# EAGLE design geyser-001 (EAGLE 8.7.0)
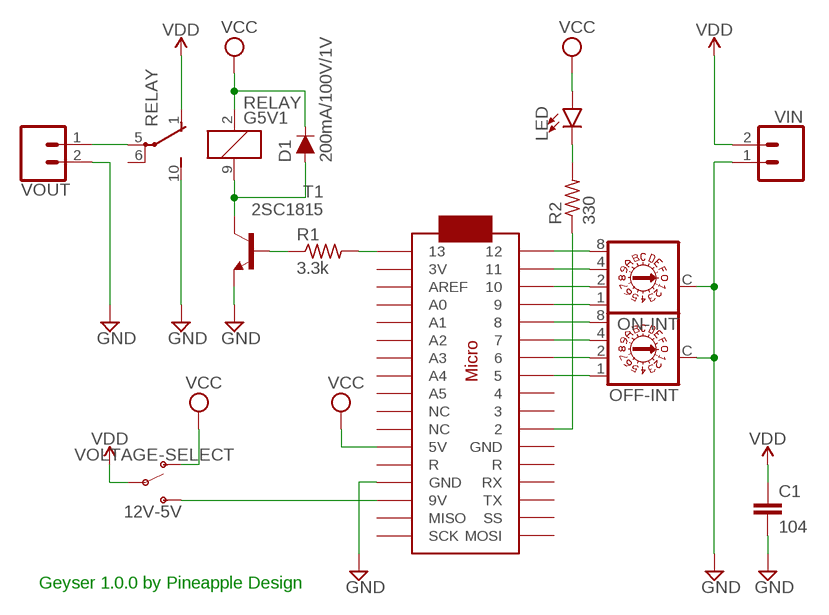
[diagram p0: schematic, sheet 1]

## Parts
C1  104  C2,5-3  [C2.5-3]
D1  200mA/100V/1V  DIODE-1N4148  [DIODE-1N4148]
LED  LED-3MM-NO_SILK  [LED_3MM-NS]
OFF-INT  A1353HEX  [A1353HEX]
ON-INT  A1353HEX  [A1353HEX]
R1  3.3k  R-US_0204/5  [0204/5]
R2  330  R-US_0204/5  [0204/5]
RELAY  G5V1  [G5V1]
T1  2SC1815  [TO92-ECB]
U$1  ARDUINOMICRO  [ARDUINOMICRO]
VIN  CONN_02JST-PTH-2  [JST-2-PTH]
VOLTAGE-SELECT  12V-5V  SWITCH-SPDT-PTH-11.6X4.0MM  [SWITCH_SPDT_PTH_11.6X4.0MM]
VOUT  CONN_02JST-PTH-2  [JST-2-PTH]

## Nets
GND: C1.2 OFF-INT.C ON-INT.C RELAY.10(2:S) T1.E U$1.P$12(GND) VIN.1 VOUT.2
LEDDRIVE: R2.1 U$1.P$11
N$2: OFF-INT.8 U$1.P$5
N$3: R1.1 T1.B
N$4: D1.A RELAY.9 T1.C
N$5: OFF-INT.4 U$1.P$6
N$6: OFF-INT.2 U$1.P$7
N$7: ON-INT.8 U$1.P$1
N$8: ON-INT.4 U$1.P$2
N$9: ON-INT.2 U$1.P$3
N$10: ON-INT.1 U$1.P$4
N$11: OFF-INT.1 U$1.P$8
N$14: LED.K(C) R2.2
RELAYDRIVE: R1.2 U$1.P$34
VCC: D1.C LED.A RELAY.2 U$1.P$23(5V) VOLTAGE-SELECT.1(O)
VDD: C1.1 RELAY.1(2:O) VIN.2 VOLTAGE-SELECT.2(P)
VIN: U$1.P$20(9V) VOLTAGE-SELECT.3(S)
VOUT: RELAY.5(2:P) VOUT.1
Unconnected: RELAY.6(2:P) U$1.P$9 U$1.P$10 U$1.P$13(R) U$1.P$14(RX) U$1.P$15(TX) U$1.P$16(SS) U$1.P$17(MOSI) U$1.P$18(SCK) U$1.P$19(MISO) U$1.P$21(GND) U$1.P$22(R) U$1.P$24(NC) U$1.P$25(NC) U$1.P$26(A5) U$1.P$27(A4) U$1.P$28(A3) U$1.P$29(A2) U$1.P$30(A1) U$1.P$31(A0) U$1.P$32(AREF) U$1.P$33(3V)

## Notes on the sheet
- Geyser 1.0.0 by Pineapple Design

## Library data of the parts
C1 = capacitor-wima:C: CAPACITOR naming: grid - package width
D1 = SparkFun-DiscreteSemi:DIODE: Diode These are standard reverse protection diodes and small signal diodes. SparkFun Products: SparkFun SparkPunk Sound Kit <https://www.sparkfun.com/products/11177> SparkFun ESP8266 Thing <https://www.sparkfun.com/products/13231>; PROD_ID: DIO-08378
LED = SparkFun-LED:LED: LED (Generic) Standard schematic elements and footprints for 5mm, 3mm, 1206, and 0603 sized LEDs. Generic LEDs with no color specified.
OFF-INT ON-INT = switch-dil:A1353HEX: DIL/CODE SWITCH; OC_FARNELL: unknown; OC_NEWARK: unknown
R1 R2 = resistor:R-US_: RESISTOR, American symbol
RELAY = relay:G5V1: RELAY 1 x switch, 0.5 A/125 V AC, 1 A/24 V DC , Omron; MPN: G5V-1-DC24; OC_FARNELL: 9949593; OC_NEWARK: 36M6377
T1 = transistor:2SC1815: NPN EPITAXIAL TRANSISTOR Source: TOSHIBA .. 2SC1815 1.pdf
U$1 = adafruit:ARDUINOMICRO
VIN VOUT = SparkFun-Connectors:CONN_02: Multi connection point. Often used as Generic Header-pin footprint for 0.1 inch spaced/style header connections On any of the 0.1 inch spaced packages, you can populate with these: Break Away Headers - Straight <https://www.sparkfun.com/products/116> (PRT-00116) Break Away Male Headers - Right Angle <https://www.sparkfun.com/products/553> (PRT-00553) Female Headers <https://www.sparkfun.com/products/115> (PRT-00115) Break Away Headers - Machine Pin <https://www.sparkfun.com/products/117> (PRT-00117) Break Away Female Headers - Swiss Machine Pin <https://www.sparkfun.com/products/743> (PRT-00743) For SCREWTERMINALS and SPRING TERMINALS visit here: Screw Terimnals on SparkFun.com <https://www.sparkfun.com/search/results?term=Screw+Terminals> (5mm/3.5mm/2.54mm spacing) This device is also useful as a general connection point to wire up your design to another part of your project. Our various solder wires solder well into these plated through hole pads. Hook-Up Wire - Assortment (Stranded, 22 AWG) <https://www.sparkfun.com/products/11375> (PRT-11375) Hook-Up Wire - Assortment (Solid Core, 22 AWG) <https://www.sparkfun.com/products/11367> (PRT-11367) View the entire wire category on our website here <https://www.sparkfun.com/categories/141> Special notes: Molex polarized connector foot print use with: PRT-08233 with associated crimp pins and housings. 2.54_SCREWTERM for use with PRT-10571. 3.5mm Screw Terminal footprints for PRT-08084 5mm Screw Terminal footprints for use with PRT-08432; PROD_ID: CONN-09863; SKU: PRT-09914
VOLTAGE-SELECT = SparkFun-Switches:SWITCH-SPDT: Single Pole, Double Throw (SPDT) Switch Single-pole, double-throw (SPDT) switch. Variant Overview SMD-AYZ0202 Surface Mount DPDT Switch <https://www.sparkfun.com/products/597> (COM-00597) Used on e.g. LilyPad Arduino USB - ATmega32U4 Board <https://www.sparkfun.com/products/12049> PTH-11.6X4.0MM SPDT Mini Power Switch <https://www.sparkfun.com/products/102> (COM-00102) Used on e.g. SparkFun Simon Says - Through-Hole Soldering Kit <https://www.sparkfun.com/products/10547> (KIT-10547) PTH-11.6X4.0MM-KIT KIT version of SPDT Mini Power Switch - Simplifies soldering by removing tStop of switch pins - only one side can be soldered. PTH-11.6X4.0MM-LOCK LOCK version of SPDT Mini Power Switch - Offset pins hold switch in place for easier soldering. SMD-RIGHT-ANGLE Surface Mount Right Angle Switch <https://www.sparkfun.com/products/10860> (COM-10860) Used on e.g. SparkFun ESP8266 Thing <https://www.sparkfun.com/products/13231>; PROD_ID: SWCH-08261; SF_SKU: COM-00102

## Net classes
0 default: width 0.254 mm, drill 0.254 mm, clearance 0.254 mm

## Board
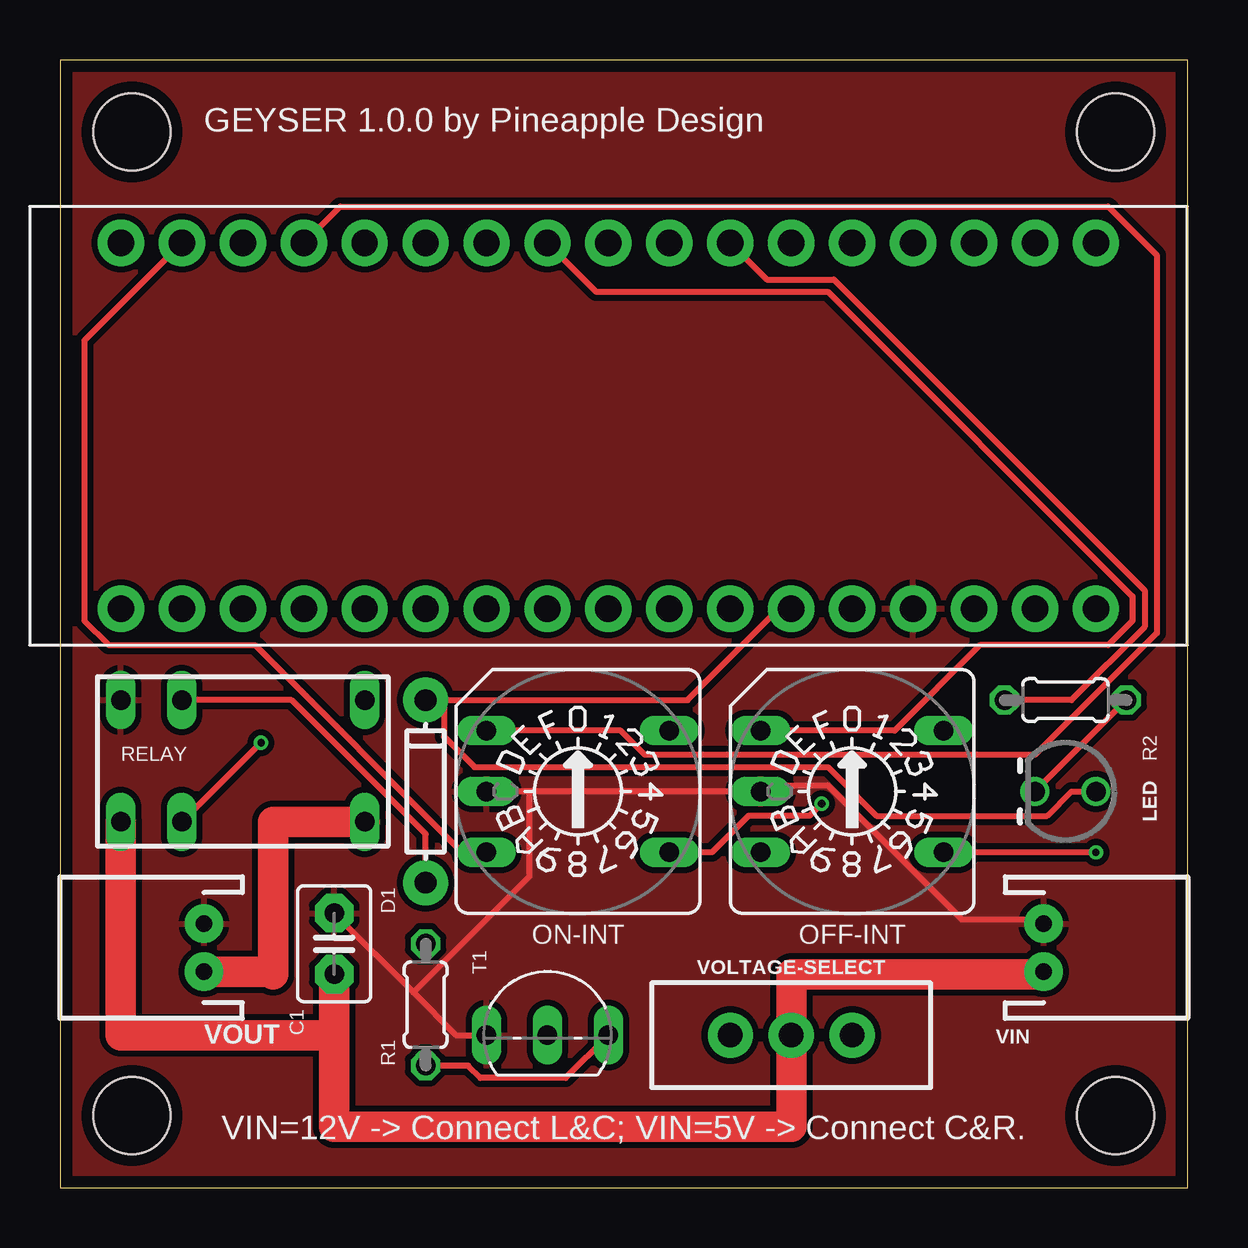
[diagram p1: board, top side]
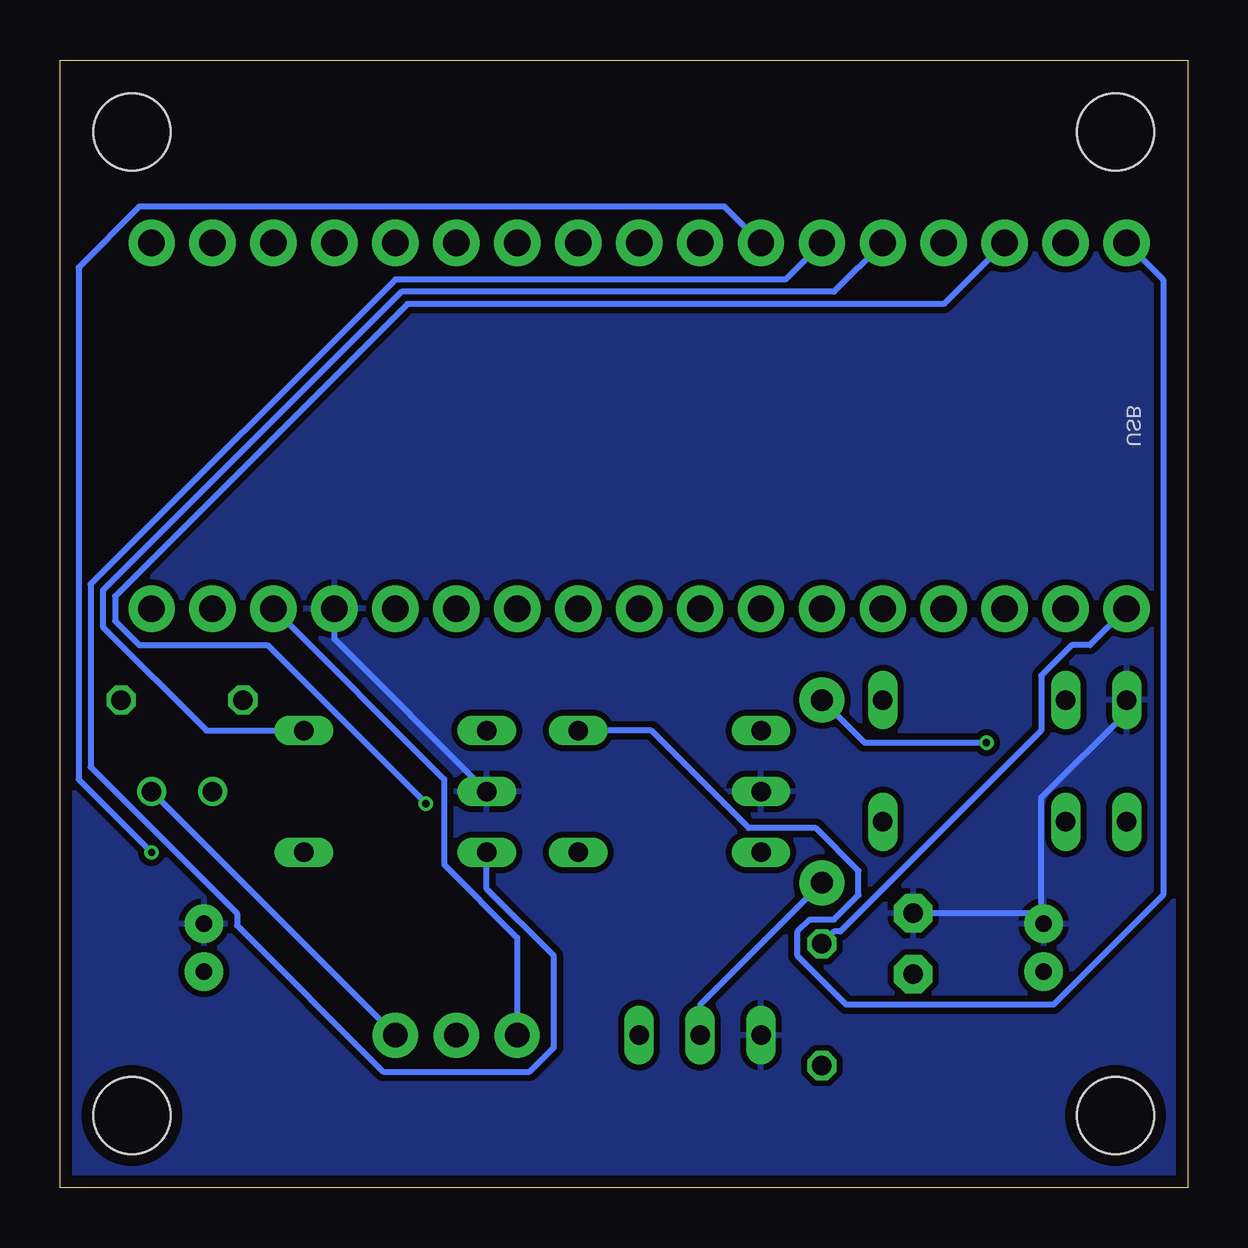
[diagram p2: board, bottom side, seen from below]

Size 47 x 47 mm. Coordinates in mm from the lower left corner, seen from the top.
Outline: 0,0 47,0 47,47 0,47 0,0
Copper layers (1*16): Top 0.035mm / dielectric 1.53mm / Bottom 0.035mm
Design rules "pban_5mil-l2": minimum track width 5mil, minimum drill 0.3mm, track to track 5mil, track to pad 0.229mm, pad to pad 5mil, via to via 5mil, smd to smd 5mil, copper to edge 0.5mm, drill to drill 0.5mm, minimum pad ring 0.15mm, minimum via ring 0.15mm, stop-mask expansion 4mil, vias tented up to drill 0.35mm, thermal gap 10mil
Holes 3.2 mm at 3,3 44,3 3,44 44,44

### Footprints (pad centres in the part's own frame; a part is rotated, then mirrored left to right if it is on the bottom)
C2.5-3 = drill 0.813 pad 1.6 octagon: 1 -1.27,0; 2 1.27,0
DIODE-1N4148 = drill 0.9 pad 1.88: A -3.81,0; C 3.81,0
LED_3MM-NS = drill 0.813: A -1.27,0; K 1.27,0
A1353HEX = drill 0.813 long: 1 3.81,-2.54; 2 -3.81,2.54; 4 3.81,2.54; 8 -3.81,-2.54; C 3.81,0
0204/5 = drill 0.813 octagon: 1 -2.54,0; 2 2.54,0
G5V1 = drill 0.813 long: 1 -5.08,-2.54; 2 -2.54,-2.54; 5 5.08,-2.54; 6 5.08,2.54; 9 -2.54,2.54; 10 -5.08,2.54
TO92-ECB = drill 0.813 long: B 2.54,0; C 0,0; E -2.54,0
ARDUINOMICRO = drill 1.1 pad 1.93: P$1 -20.32,7.62; P$2 -17.78,7.62; P$3 -15.24,7.62; P$4 -12.7,7.62; P$5 -10.16,7.62; P$6 -7.62,7.62; P$7 -5.08,7.62; P$8 -2.54,7.62; P$9 0,7.62; P$10 2.54,7.62; P$11 5.08,7.62; P$12 12.7,-7.62; P$13 10.16,-7.62; P$14 12.7,7.62; P$15 15.24,7.62; P$16 17.78,7.62; P$17 20.32,7.62; P$18 20.32,-7.62; P$19 17.78,-7.62; P$20 15.24,-7.62; P$21 7.62,7.62; P$22 10.16,7.62; P$23 7.62,-7.62; P$24 5.08,-7.62; P$25 2.54,-7.62; P$26 0,-7.62; P$27 -2.54,-7.62; P$28 -5.08,-7.62; P$29 -7.62,-7.62; P$30 -10.16,-7.62; P$31 -12.7,-7.62; P$32 -15.24,-7.62; P$33 -17.78,-7.62; P$34 -20.32,-7.62
JST-2-PTH = drill 0.7 pad 1.6: 1 -1,0; 2 1,0
SWITCH_SPDT_PTH_11.6X4.0MM = drill 1.016 pad 1.88: 1 0,2.54; 2 0,0; 3 0,-2.54

### Placement (x,y rotation side)
C1  11.43,10.16 90 top
D1  15.24,16.51 90 top
LED  41.91,16.51 180 top
OFF-INT  33.02,16.51 180 top
ON-INT  21.59,16.51 180 top
R1  15.24,7.62 90 top
R2  41.91,20.32 0 top
RELAY  7.62,17.78 0 top
T1  20.32,6.35 0 top
U$1  22.86,31.75 0 top
VIN  41,10 270 top
VOLTAGE-SELECT  30.48,6.35 270 top
VOUT  6,10 90 top

### Tracks (layer width: path | path; a pad name or v marks a point on that pad's centre or on a via)
GND
  Top 0.254: T1.E 16.51,6.35 14.73,8.13 | C1.2 14.73,8.13 | 19.56,16.51 OFF-INT.C 29.46,16.76 32,16.76 37.59,11.18 40.89,11.18 VIN.1 | 19.56,16.51 ON-INT.C | 14.73,8.13 19.56,12.95 19.56,16.51
  Bottom 0.254: RELAY.10 2.54,19.81 6.1,16.26 6.1,11.43 | 6.1,11.43 6.1,11.18 VOUT.2 6.1,11.43 | 6.1,11.43 C1.2 | U$1.P$12 35.56,22.86 OFF-INT.C
  pour Top (isolate 0.254): 0,0 47,0 47,47 0,47
  pour Bottom (isolate 0.254): 0,0 47,0 47,47 0,47
LEDDRIVE
  Top 0.254: R2.1 42.16,20.32 45.21,23.37 45.21,24.89 32.26,37.85 29.46,37.85 U$1.P$11
N$2
  Bottom 0.254: OFF-INT.8 40.89,19.05 45.21,23.37 45.21,24.89 32.77,37.34 14.73,37.34 U$1.P$5
N$3
  Top 0.254: R1.1 17.02,5.08 17.53,4.57 21.08,4.57 T1.B
N$4
  Top 0.254: RELAY.9 9.65,20.32 15.24,14.73 D1.A
  Bottom 0.254: T1.C 20.32,7.62 D1.A
N$5
  Bottom 0.254: OFF-INT.4 29.21,12.45 26.42,9.65 26.42,5.84 27.43,4.83 33.53,4.83 39.62,10.92 39.62,11.43 45.72,17.53 45.72,25.15 33.02,37.85 16.76,37.85 U$1.P$6
N$6  (via drill 0.3)
  Top 0.254: v43.18,13.97 OFF-INT.2
  Bottom 0.254: v43.18,13.97 46.23,17.02 46.23,38.35 43.69,40.89 19.3,40.89 U$1.P$7
N$7
  Bottom 0.254: ON-INT.8 22.35,19.05 18.29,14.99 15.49,14.99 13.72,13.21 13.72,12.19 14.73,11.18 15.75,11.18 16.26,10.67 16.26,9.65 14.22,7.62 5.59,7.62 1.02,12.19 1.02,37.85 U$1.P$1
N$8
  Top 0.254: ON-INT.4 16.76,13.97 8.13,22.61 2.03,22.61 1.02,23.62 1.02,35.31 U$1.P$2
N$9  (via drill 0.3)
  Top 0.254: ON-INT.2 27.18,13.97 28.7,15.49 31.24,15.49 v31.75,16
  Bottom 0.254: v31.75,16 38.35,22.61 43.69,22.61 44.7,23.62 44.7,24.64 32.51,36.83 10.16,36.83 U$1.P$3
N$10
  Top 0.254: ON-INT.1 23.37,19.05 24.38,18.03 40.64,18.03 45.72,23.11 45.72,38.86 43.69,40.89 11.68,40.89 U$1.P$4
N$11
  Top 0.254: OFF-INT.1 34.8,19.05 38.35,22.61 43.69,22.61 44.7,23.62 44.7,24.64 32,37.34 22.35,37.34 U$1.P$8
N$14
  Top 0.254: R2.2 LED.K
RELAYDRIVE
  Bottom 0.254: R1.2 14.73,10.67 14.48,10.67 6.1,19.05 6.1,21.34 4.83,22.61 4.06,22.61 U$1.P$34
VCC  (via drill 0.3)
  Top 0.254: v8.38,18.54 RELAY.2 | U$1.P$23 29.97,24.13 26.16,20.32 16,20.32 | LED.A 42.16,16.51 41.15,15.49 34.04,15.49 32,17.53 17.27,17.53 16,18.8 16,20.32 | 16,20.32 D1.C
  Bottom 0.254: VOLTAGE-SELECT.1 LED.A | v8.38,18.54 13.46,18.54 D1.C
VDD
  Top 1.27: 11.43,6.35 11.43,2.54 30.48,2.54 VOLTAGE-SELECT.2 30.48,8.89 40.89,8.89 VIN.2 | 11.43,6.35 C1.1 | RELAY.1 2.54,6.35 11.43,6.35
VIN
  Bottom 0.152: 28.04,6.5 VOLTAGE-SELECT.3
  Bottom 0.254: VOLTAGE-SELECT.3 27.94,10.41 30.99,13.46 30.99,17.02 U$1.P$20
VOUT
  Top 1.27: VOUT.1 8.78,9 8.89,8.89 8.89,15.24 RELAY.5

### Text on the board
tNames: GEYSER 1.0.0 by Pineapple Design | VIN=12V -> Connect L&C; VIN=5V -> Connect C&R.
bNames: USB